# EAGLE schematic prototype_board (EAGLE 6.3)
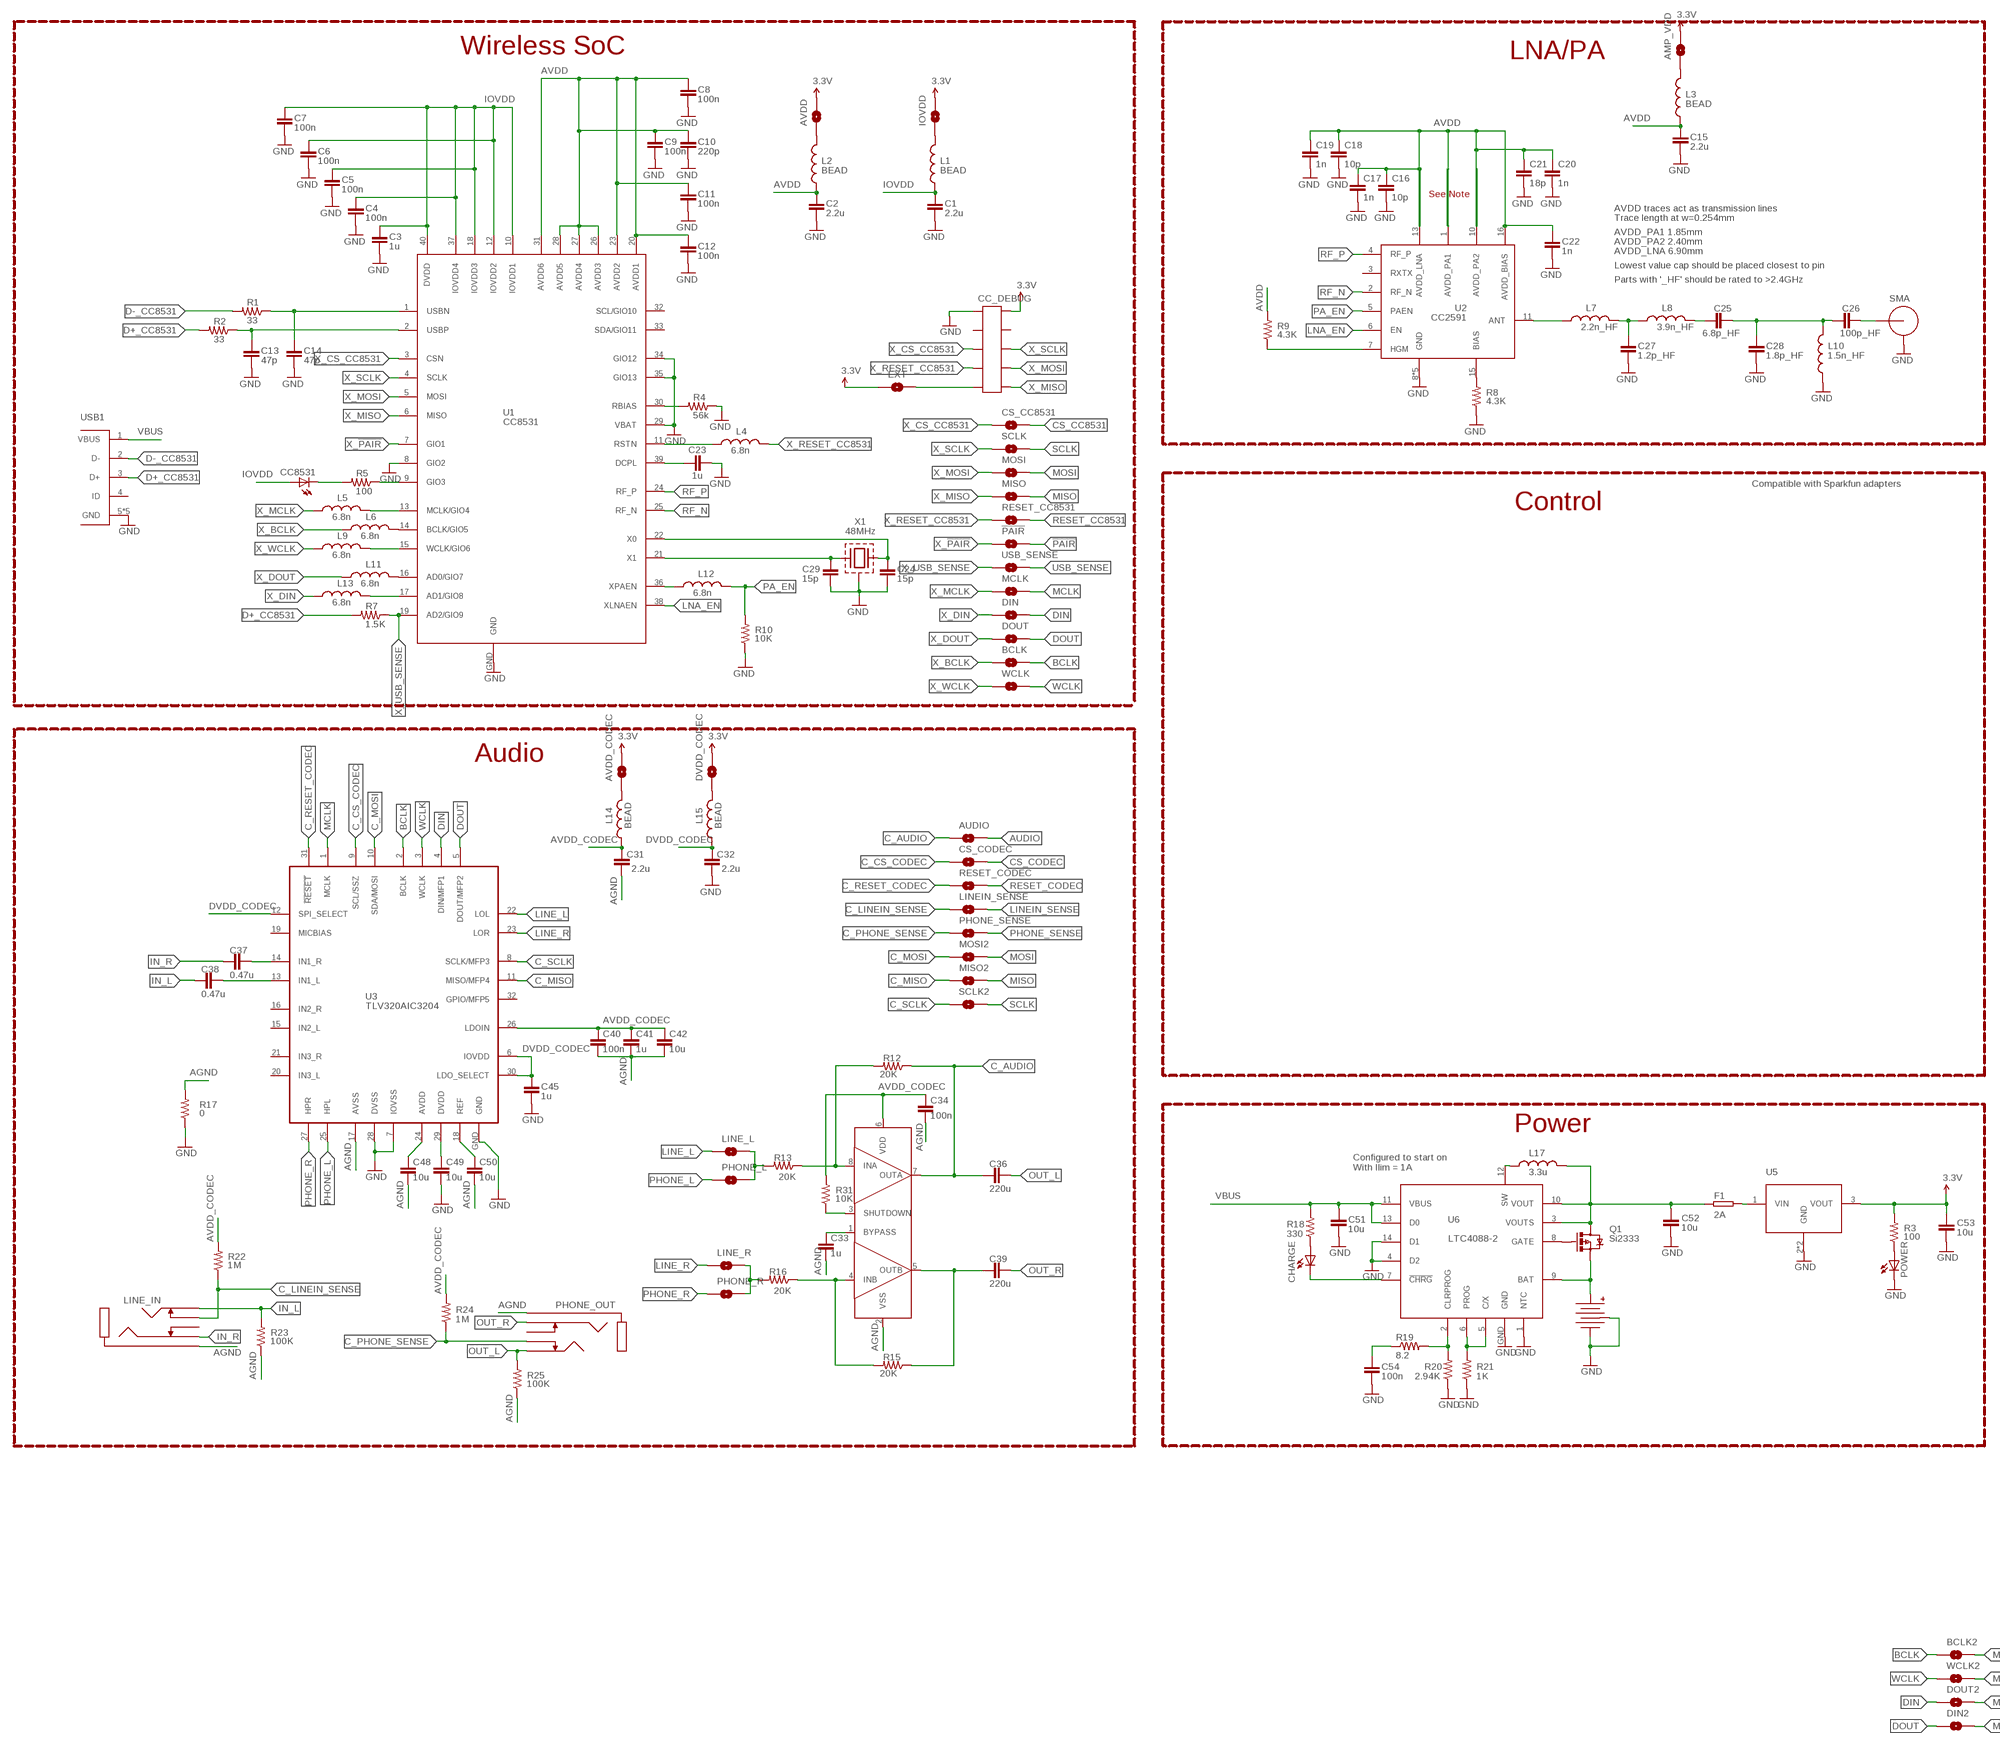
[diagram p0: schematic, sheet 1, part 1 of 3]
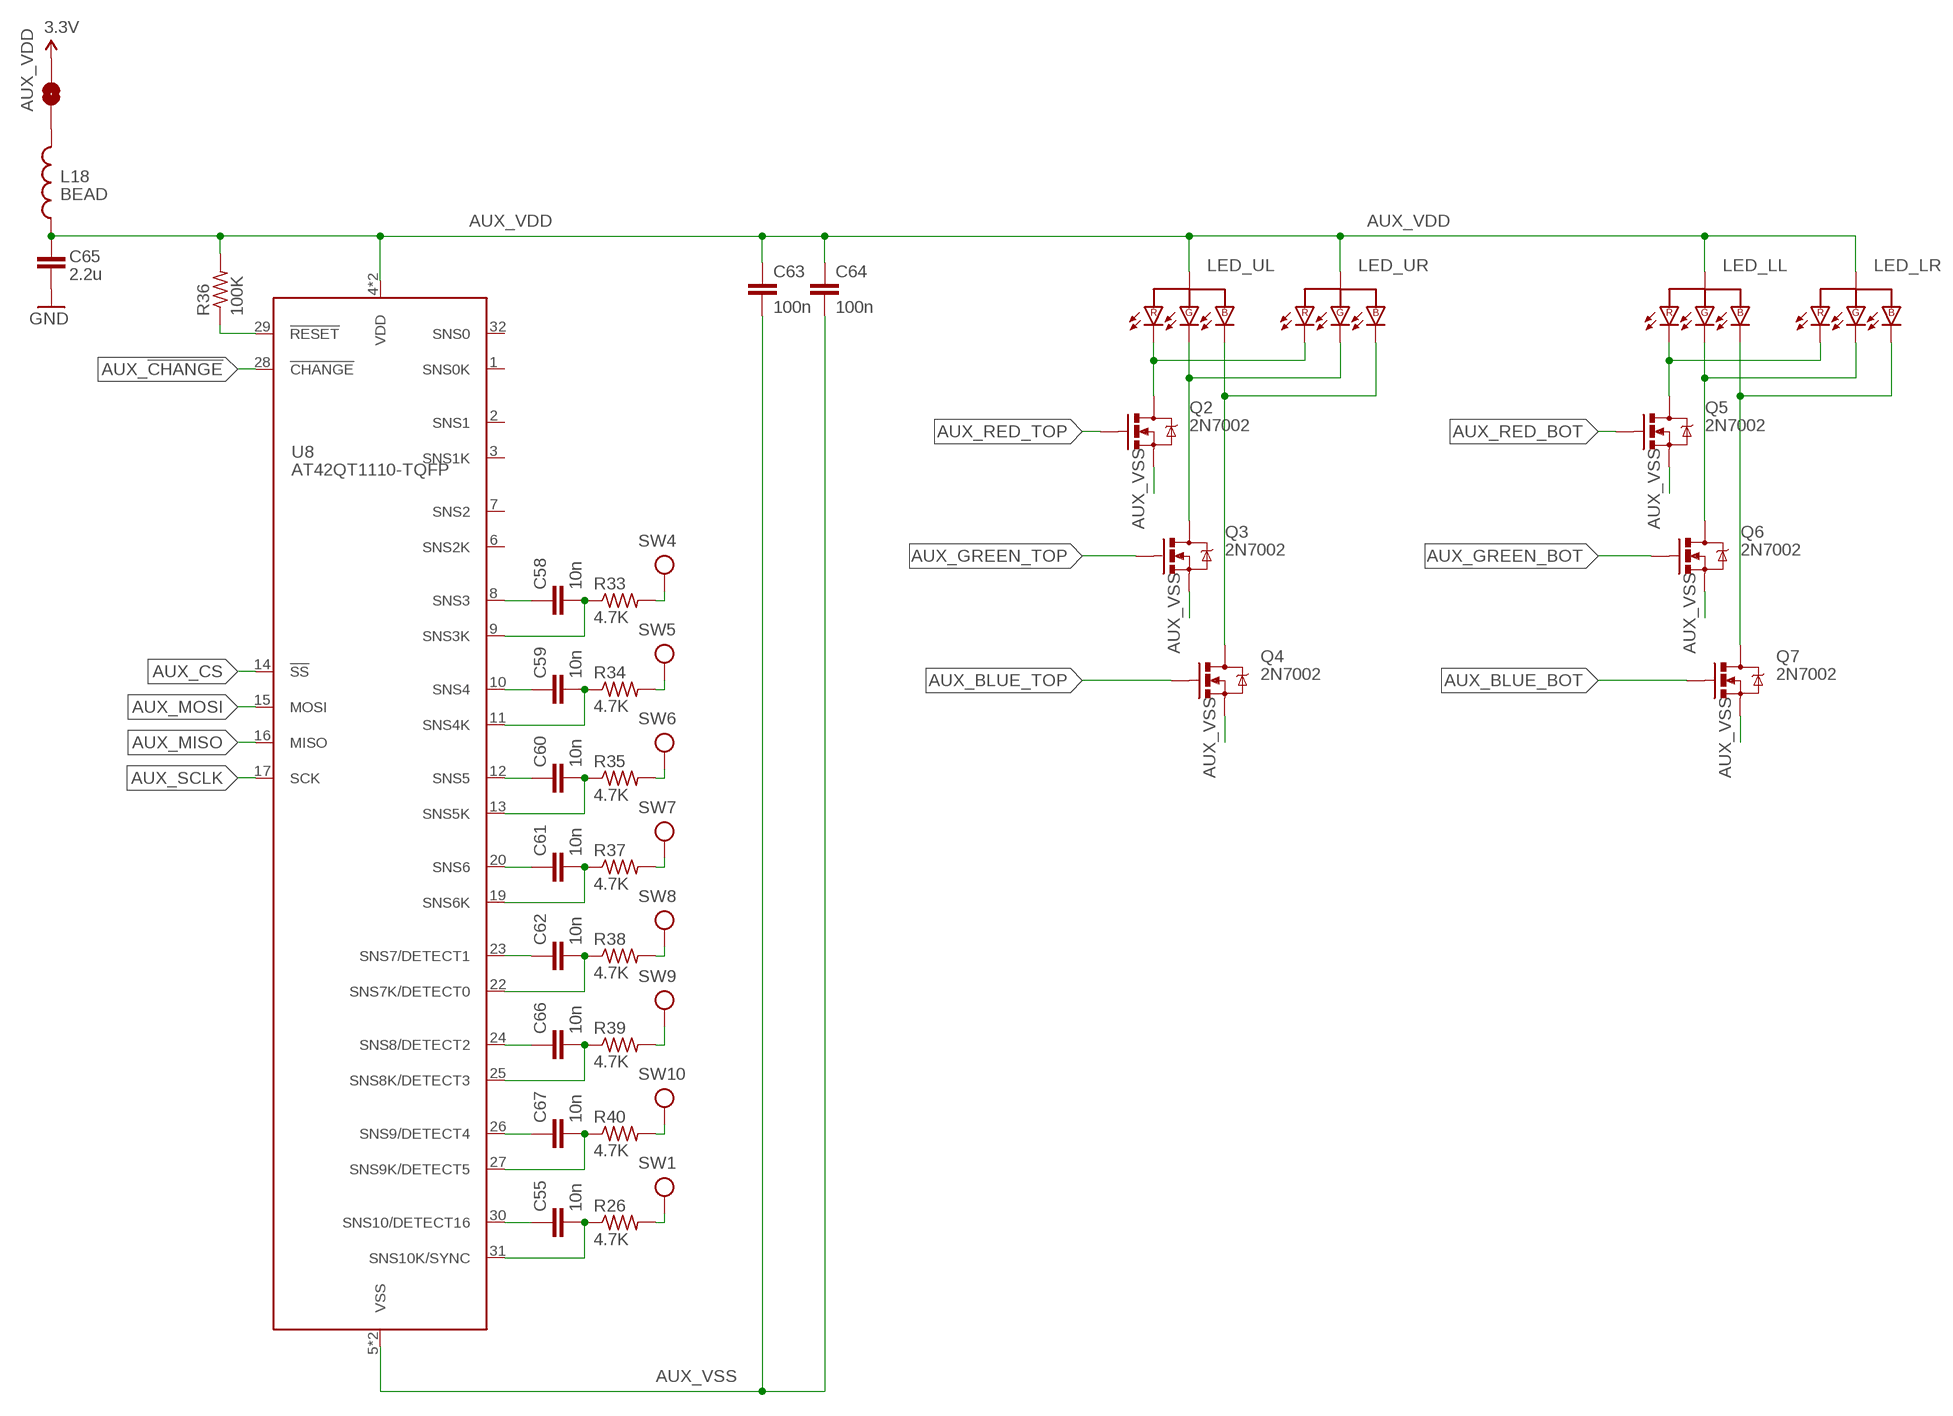
[diagram p1: schematic, sheet 1, part 2 of 3]
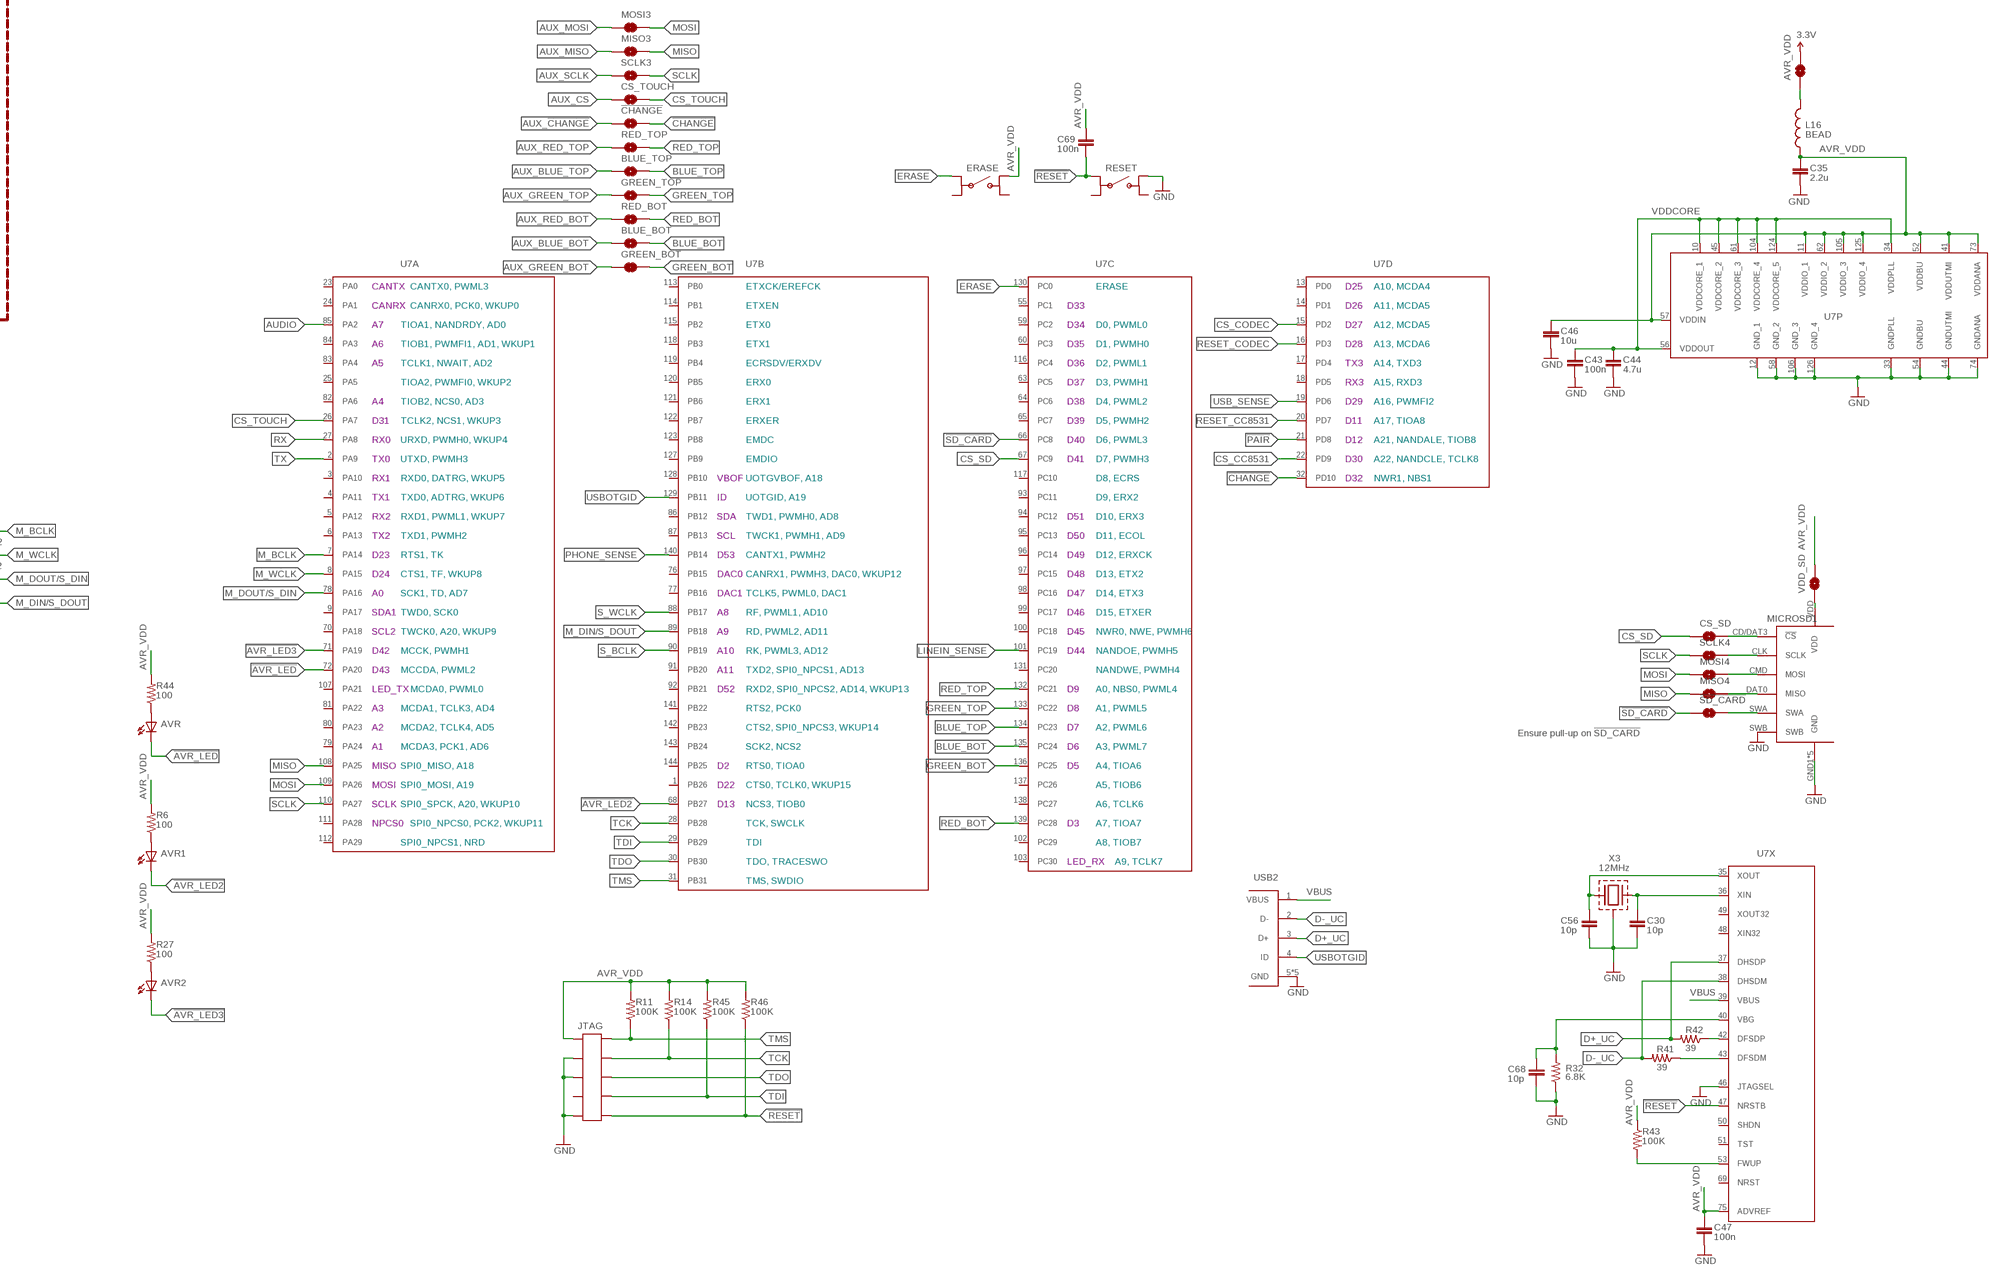
[diagram p2: schematic, sheet 1, part 3 of 3]

## Parts
!CHANGE  SOLDERJUMPERNO  [SJ_2S-NO]
!PAIR  SOLDERJUMPERNO  [SJ_2S-NO]
!SD_CARD  SOLDERJUMPERNO  [SJ_2S-NO]
AMP_VDD  SOLDERJUMPERNO  [SJ_2S-NO]
AUDIO  SOLDERJUMPERNO  [SJ_2S-NO]
AUX_VDD  SOLDERJUMPERNO  [SJ_2S-NO]
AVDD  SOLDERJUMPERNO  [SJ_2S-NO]
AVDD_CODEC  SOLDERJUMPERNO  [SJ_2S-NO]
AVR  LED1206  [LED-1206]
AVR1  LED1206  [LED-1206]
AVR2  LED1206  [LED-1206]
AVR_VDD  SOLDERJUMPERNO  [SJ_2S-NO]
BATTERY  BATTERY-LIPO-JST  [1775469-2]
BCLK  SOLDERJUMPERNO  [SJ_2S-NO]
BCLK2  SOLDERJUMPERNO  [SJ_2S-NO]
BLUE_BOT  SOLDERJUMPERNO  [SJ_2S-NO]
BLUE_TOP  SOLDERJUMPERNO  [SJ_2S-NO]
C1  2.2u  C-EUC0603  [C0603]
C2  2.2u  C-EUC0603  [C0603]
C3  1u  C-EUC0603  [C0603]
C4  100n  C-EUC0603  [C0603]
C5  100n  C-EUC0603  [C0603]
C6  100n  C-EUC0603  [C0603]
C7  100n  C-EUC0603  [C0603]
C8  100n  C-EUC0603  [C0603]
C9  100n  C-EUC0603  [C0603]
C10  220p  C-EUC0603  [C0603]
C11  100n  C-EUC0603  [C0603]
C12  100n  C-EUC0603  [C0603]
C13  47p  C-EUC0603  [C0603]
C14  47p  C-EUC0603  [C0603]
C15  2.2u  C-EUC0603  [C0603]
C16  10p  C-EUC0603  [C0603]
C17  1n  C-EUC0603  [C0603]
C18  10p  C-EUC0603  [C0603]
C19  1n  C-EUC0603  [C0603]
C20  1n  C-EUC0603  [C0603]
C21  18p  C-EUC0603  [C0603]
C22  1n  C-EUC0603  [C0603]
C23  1u  C-EUC0603  [C0603]
C24  15p  C-EUC0603  [C0603]
C25  6.8p_HF  C-EUC0603  [C0603]
C26  100p_HF  C-EUC0603  [C0603]
C27  1.2p_HF  C-EUC0603  [C0603]
C28  1.8p_HF  C-EUC0603  [C0603]
C29  15p  C-EUC0603  [C0603]
C30  10p  C-EUC0603  [C0603]
C31  2.2u  C-EUC0603  [C0603]
C32  2.2u  C-EUC0603  [C0603]
C33  1u  C-EUC0603  [C0603]
C34  100n  C-EUC0603  [C0603]
C35  2.2u  C-EUC0603  [C0603]
C36  220u  C-EUC1210  [C1210]
C37  0.47u  C-EUC0603  [C0603]
C38  0.47u  C-EUC0603  [C0603]
C39  220u  C-EUC1210  [C1210]
C40  100n  C-EUC0603  [C0603]
C41  1u  C-EUC0603  [C0603]
C42  10u  C-EUC0603  [C0603]
C43  100n  C-EUC0603  [C0603]
C44  4.7u  C-EUC0603  [C0603]
C45  1u  C-EUC0603  [C0603]
C46  10u  C-EUC0603  [C0603]
C47  100n  C-EUC0603  [C0603]
C48  10u  C-EUC0603  [C0603]
C49  10u  C-EUC0603  [C0603]
C50  10u  C-EUC0603  [C0603]
C51  10u  C-EUC0603  [C0603]
C52  10u  C-EUC0603  [C0603]
C53  10u  C-EUC0603  [C0603]
C54  100n  C-EUC0603  [C0603]
C55  10n  C-EUC0603  [C0603]
C56  10p  C-EUC0603  [C0603]
C58  10n  C-EUC0603  [C0603]
C59  10n  C-EUC0603  [C0603]
C60  10n  C-EUC0603  [C0603]
C61  10n  C-EUC0603  [C0603]
C62  10n  C-EUC0603  [C0603]
C63  100n  C-EUC0603  [C0603]
C64  100n  C-EUC0603  [C0603]
C65  2.2u  C-EUC0603  [C0603]
C66  10n  C-EUC0603  [C0603]
C67  10n  C-EUC0603  [C0603]
C68  10p  C-EUC0603  [C0603]
C69  100n  C-EUC0603  [C0603]
CC8531  LED1206  [LED-1206]
CC_DEBUG  HEADER-10P-SMD-MALE2  [HEADER-10P-1.27MM]
CHARGE  LED1206  [LED-1206]
CS_CC8531  SOLDERJUMPERNO  [SJ_2S-NO]
CS_CODEC  SOLDERJUMPERNO  [SJ_2S-NO]
CS_SD  SOLDERJUMPERNO  [SJ_2S-NO]
CS_TOUCH  SOLDERJUMPERNO  [SJ_2S-NO]
DIN  SOLDERJUMPERNO  [SJ_2S-NO]
DIN2  SOLDERJUMPERNO  [SJ_2S-NO]
DOUT  SOLDERJUMPERNO  [SJ_2S-NO]
DOUT2  SOLDERJUMPERNO  [SJ_2S-NO]
DVDD_CODEC  SOLDERJUMPERNO  [SJ_2S-NO]
ERASE  TACT_SWITCH-PTS-525  [PTS-525]
EXT  SOLDERJUMPERNO  [SJ_2S-NO]
F1  2A  PTC_FUSE  [1210]
GREEN_BOT  SOLDERJUMPERNO  [SJ_2S-NO]
GREEN_TOP  SOLDERJUMPERNO  [SJ_2S-NO]
IOVDD  SOLDERJUMPERNO  [SJ_2S-NO]
JTAG  HEADER-10P-SMD-MALE2  [HEADER-10P-1.27MM]
L1  BEAD  INDUCTOR0603  [0603]
L2  BEAD  INDUCTOR0603  [0603]
L3  BEAD  INDUCTOR0603  [0603]
L4  6.8n  INDUCTOR0603  [0603]
L5  6.8n  INDUCTOR0603  [0603]
L6  6.8n  INDUCTOR0603  [0603]
L7  2.2n_HF  INDUCTOR0603  [0603]
L8  3.9n_HF  INDUCTOR0603  [0603]
L9  6.8n  INDUCTOR0603  [0603]
L10  1.5n_HF  INDUCTOR0603  [0603]
L11  6.8n  INDUCTOR0603  [0603]
L12  6.8n  INDUCTOR0603  [0603]
L13  6.8n  INDUCTOR0603  [0603]
L14  BEAD  INDUCTOR0603  [0603]
L15  BEAD  INDUCTOR0603  [0603]
L16  BEAD  INDUCTOR0603  [0603]
L17  3.3u  IFSC-1111AB-01  [IFSC-1111AB-01]
L18  BEAD  INDUCTOR0603  [0603]
LED_LL  LED_RGB  [PLCC-4]
LED_LR  LED_RGB  [PLCC-4]
LED_UL  LED_RGB  [PLCC-4]
LED_UR  LED_RGB  [PLCC-4]
LINE_IN  PHONE_SW-STX-35332-5N  [STX-35332-5N]
LINE_L  SOLDERJUMPERNO  [SJ_2S-NO]
LINE_R  SOLDERJUMPERNO  [SJ_2S-NO]
LINEIN_SENSE  SOLDERJUMPERNO  [SJ_2S-NO]
MCLK  SOLDERJUMPERNO  [SJ_2S-NO]
MICROSD1  MICROSD104031-0811  [MOLEX_104031-0811]
MISO  SOLDERJUMPERNO  [SJ_2S-NO]
MISO2  SOLDERJUMPERNO  [SJ_2S-NO]
MISO3  SOLDERJUMPERNO  [SJ_2S-NO]
MISO4  SOLDERJUMPERNO  [SJ_2S-NO]
MOSI  SOLDERJUMPERNO  [SJ_2S-NO]
MOSI2  SOLDERJUMPERNO  [SJ_2S-NO]
MOSI3  SOLDERJUMPERNO  [SJ_2S-NO]
MOSI4  SOLDERJUMPERNO  [SJ_2S-NO]
PHONE_L  SOLDERJUMPERNO  [SJ_2S-NO]
PHONE_OUT  PHONE_SW-STX-35332-5N  [STX-35332-5N]
PHONE_R  SOLDERJUMPERNO  [SJ_2S-NO]
PHONE_SENSE  SOLDERJUMPERNO  [SJ_2S-NO]
POWER  LED1206  [LED-1206]
Q1  Si2333  MOSFET-PCHANNELSMD  [SOT23-3]
Q2  2N7002  MOSFET-NCHANNELSMD  [SOT23-3]
Q3  2N7002  MOSFET-NCHANNELSMD  [SOT23-3]
Q4  2N7002  MOSFET-NCHANNELSMD  [SOT23-3]
Q5  2N7002  MOSFET-NCHANNELSMD  [SOT23-3]
Q6  2N7002  MOSFET-NCHANNELSMD  [SOT23-3]
Q7  2N7002  MOSFET-NCHANNELSMD  [SOT23-3]
R1  33  R-US_R0603  [R0603]
R2  33  R-US_R0603  [R0603]
R3  100  R-US_R0603  [R0603]
R4  56k  R-US_R0603  [R0603]
R5  100  R-US_R0603  [R0603]
R6  100  R-US_R0603  [R0603]
R7  1.5K  R-US_R0603  [R0603]
R8  4.3K  R-US_R0603  [R0603]
R9  4.3K  R-US_R0603  [R0603]
R10  10K  R-US_R0603  [R0603]
R11  100K  R-US_R0603  [R0603]
R12  20K  R-US_R0603  [R0603]
R13  20K  R-US_R0603  [R0603]
R14  100K  R-US_R0603  [R0603]
R15  20K  R-US_R0603  [R0603]
R16  20K  R-US_R0603  [R0603]
R17  0  R-US_R0603  [R0603]
R18  330  R-US_R0603  [R0603]
R19  8.2  R-US_R0603  [R0603]
R20  2.94K  R-US_R0603  [R0603]
R21  1K  R-US_R0603  [R0603]
R22  1M  R-US_R0603  [R0603]
R23  100K  R-US_R0603  [R0603]
R24  1M  R-US_R0603  [R0603]
R25  100K  R-US_R0603  [R0603]
R26  4.7K  R-US_R0603  [R0603]
R27  100  R-US_R0603  [R0603]
R31  10K  R-US_R0603  [R0603]
R32  6.8K  R-US_R0603  [R0603]
R33  4.7K  R-US_R0603  [R0603]
R34  4.7K  R-US_R0603  [R0603]
R35  4.7K  R-US_R0603  [R0603]
R36  100K  R-US_R0603  [R0603]
R37  4.7K  R-US_R0603  [R0603]
R38  4.7K  R-US_R0603  [R0603]
R39  4.7K  R-US_R0603  [R0603]
R40  4.7K  R-US_R0603  [R0603]
R41  39  R-US_R0603  [R0603]
R42  39  R-US_R0603  [R0603]
R43  100K  R-US_R0603  [R0603]
R44  100  R-US_R0603  [R0603]
R45  100K  R-US_R0603  [R0603]
R46  100K  R-US_R0603  [R0603]
RED_BOT  SOLDERJUMPERNO  [SJ_2S-NO]
RED_TOP  SOLDERJUMPERNO  [SJ_2S-NO]
RESET  TACT_SWITCH-PTS-525  [PTS-525]
RESET_CC8531  SOLDERJUMPERNO  [SJ_2S-NO]
RESET_CODEC  SOLDERJUMPERNO  [SJ_2S-NO]
SCLK  SOLDERJUMPERNO  [SJ_2S-NO]
SCLK2  SOLDERJUMPERNO  [SJ_2S-NO]
SCLK3  SOLDERJUMPERNO  [SJ_2S-NO]
SCLK4  SOLDERJUMPERNO  [SJ_2S-NO]
SMA  SMA-REVSMA-0.62  [CONREVSMA003.062]
SW1  TOUCH_PAD-CIRCLE-15MM  [TOUCH-CIRCLE-15MM]
SW4  TOUCH_PAD-CIRCLE-15MM  [TOUCH-CIRCLE-15MM]
SW5  TOUCH_PAD-CIRCLE-15MM  [TOUCH-CIRCLE-15MM]
SW6  TOUCH_PAD-CIRCLE-15MM  [TOUCH-CIRCLE-15MM]
SW7  TOUCH_PAD-CIRCLE-15MM  [TOUCH-CIRCLE-15MM]
SW8  TOUCH_PAD-CIRCLE-15MM  [TOUCH-CIRCLE-15MM]
SW9  TOUCH_PAD-CIRCLE-15MM  [TOUCH-CIRCLE-15MM]
SW10  TOUCH_PAD-CIRCLE-15MM  [TOUCH-CIRCLE-15MM]
U1  CC8531  [S-PVQFN-N40]
U2  CC2591  [S-PVQFN-N16]
U3  TLV320AIC3204  [S-PVQFN-N32]
U5  MCP1826-SOT223  [SOT-223]
U6  LTC4088-2  LTC4088-1/2  [DFN-14]
U7  ATSAM3X8E_ALT-LQFP-144  [LQFP-144]
U8  AT42QT1110-TQFP  [S-PQFP-N32]
U9  LM4881  [SO08]
USB1  USB_MICRO_AB  [USB_MICRO_AB]
USB2  USB_MICRO_AB  [USB_MICRO_AB]
USB_SENSE  SOLDERJUMPERNO  [SJ_2S-NO]
VDD_SD  SOLDERJUMPERNO  [SJ_2S-NO]
WCLK  SOLDERJUMPERNO  [SJ_2S-NO]
WCLK2  SOLDERJUMPERNO  [SJ_2S-NO]
X1  48MHz  XTAL-ABRACONABM3C  [ABM3C]
X3  12MHz  XTAL-ABRACONABM8G  [ABM8G]

## Nets
3.3V [Power]: AMP_VDD.2 AUX_VDD.2 AVDD.2 AVDD_CODEC.2 AVR_VDD.2 C53.1 CC_DEBUG.2 DVDD_CODEC.2 EXT.1 IOVDD.2 R3.2 U5.3(VOUT)
!AVR_LED: AVR.C U7.72(A:PA20)
!AVR_LED2: AVR1.C U7.68(B:PB27)
!AVR_LED3: AVR2.C U7.71(A:PA19)
!CHANGE: !CHANGE.2 U7.32(D:PD10)
!PAIR: !PAIR.2 U7.21(D:PD8)
!RESET: C69.2 JTAG.10 R46.1 RESET.1 U7.47(X:NRSTB)
!SD_CARD: !SD_CARD.1 U7.66(C:PC8)
AGND [Analog]: C31.2 C33.2 C34.2 C40.2 C41.2 C42.2 C48.2 C50.2 LINE_IN.5(GND) PHONE_OUT.5(GND) R17.2 R23.1 R25.1 U3.17(AVSS) U9.2(VSS)
AUDIO: AUDIO.2 U7.85(A:PA2)
AUX_!CHANGE: !CHANGE.1 U8.28(!CHANGE)
AUX_BLUE_BOT: BLUE_BOT.1 Q7.1(G)
AUX_BLUE_TOP: BLUE_TOP.1 Q4.1(G)
AUX_CS: CS_TOUCH.1 U8.14(!SS)
AUX_GREEN_BOT: GREEN_BOT.1 Q6.1(G)
AUX_GREEN_TOP: GREEN_TOP.1 Q3.1(G)
AUX_MISO: MISO3.1 U8.16(MISO)
AUX_MOSI: MOSI3.1 U8.15(MOSI)
AUX_RED_BOT: Q5.1(G) RED_BOT.1
AUX_RED_TOP: Q2.1(G) RED_TOP.1
AUX_SCLK: SCLK3.1 U8.17(SCK)
AUX_VDD: C63.1 C64.1 C65.1 L18.1 LED_LL.2(A) LED_LL.2-2(A) LED_LR.2(A) LED_LR.2-2(A) LED_UL.2(A) LED_UL.2-2(A) LED_UR.2(A) LED_UR.2-2(A) R36.2 U8.4(VDD) U8.18(VDD)
AUX_VSS: C63.2 C64.2 Q2.2(S) Q3.2(S) Q4.2(S) Q5.2(S) Q6.2(S) Q7.2(S) U8.5(VSS) U8.21(VSS)
AVDD: C2.1 C8.1 C9.1 C10.1 C11.1 C12.1 C15.1 C16.1 C17.1 C18.1 C19.1 C20.1 C21.1 C22.1 L2.1 L3.1 R9.2 U1.20(AVDD1) U1.23(AVDD2) U1.26(AVDD3) U1.27(AVDD4) U1.28(AVDD5) U1.31(AVDD6) U2.1(AVDD_PA1) U2.10(AVDD_PA2) U2.13(AVDD_LNA) U2.16(AVDD_BIAS)
AVDD_CODEC: C31.1 C34.1 C40.1 C41.1 C42.1 L14.1 R22.2 R24.2 R31.2 U3.26(LDOIN) U9.6(VDD)
AVR_VDD: C35.1 C46.1 C47.1 C69.1 ERASE.3 JTAG.1 L16.1 R6.2 R11.2 R14.2 R27.2 R43.1 R44.2 R45.2 R46.2 U7.11(P:VDDIO_1) U7.41(P:VDDUTMI) U7.52(P:VDDBU) U7.57(P:VDDIN) U7.62(P:VDDIO_2) U7.73(P:VDDANA) U7.75(X:ADVREF) U7.105(P:VDDIO_3) U7.125(P:VDDIO_4) VDD_SD.2
BAT [Power]: BATTERY.+(P) Q1.2(S) U6.9(BAT)
BCLK: BCLK2.1 BCLK.2 U3.2(BCLK)
BLUE_BOT: BLUE_BOT.2 U7.135(C:PC24)
BLUE_TOP: BLUE_TOP.2 U7.134(C:PC23)
C_AUDIO: AUDIO.1 C36.1 R12.1 U9.7(OUTA)
C_CS_CODEC: CS_CODEC.1 U3.9(SCL/SSZ)
C_LINEIN_SENSE: LINE_IN.3(L_SW) LINEIN_SENSE.1 R22.1
C_MISO: MISO2.1 U3.11(MISO/MFP4)
C_MOSI: MOSI2.1 U3.10(SDA/MOSI)
C_PHONE_SENSE: PHONE_OUT.3(L_SW) PHONE_SENSE.1 R24.1
C_RESET_CODEC: RESET_CODEC.1 U3.31(!RESET)
C_SCLK: SCLK2.1 U3.8(SCLK/MFP3)
CS_CC8531: CS_CC8531.2 U7.22(D:PD9)
CS_CODEC: CS_CODEC.2 U7.15(D:PD2)
CS_SD: CS_SD.1 U7.67(C:PC9)
CS_TOUCH: CS_TOUCH.2 U7.26(A:PA7)
D+_CC8531: R2.2 R7.2 USB1.3(D+)
D+_UC: R42.2 U7.37(X:DHSDP) USB2.3(D+)
D-_CC8531: R1.2 USB1.2(D-)
D-_UC: R41.2 U7.38(X:DHSDM) USB2.2(D-)
DIN: DIN.2 DOUT2.1 U3.4(DIN/MFP1)
DOUT: DIN2.1 DOUT.2 U3.5(DOUT/MFP2)
DVDD: C49.1 U3.29(DVDD)
DVDD_CODEC: C32.1 C45.1 L15.1 U3.6(IOVDD) U3.12(SPI_SELECT) U3.30(LDO_SELECT)
ERASE: ERASE.1 U7.130(C:PC0)
GND [Power]: BATTERY.-(N) BATTERY.X1(CASE) BATTERY.X2(CASE) C1.2 C2.2 C3.2 C4.2 C5.2 C6.2 C7.2 C8.2 C9.2 C10.2 C11.2 C12.2 C13.2 C14.2 C15.2 C16.2 C17.2 C18.2 C19.2 C20.2 C21.2 C22.2 C23.2 C24.2 C27.2 C28.2 C29.2 C30.2 C32.2 C35.2 C43.2 C44.2 C45.2 C46.2 C47.2 C49.2 C51.2 C52.2 C53.2 C54.2 C56.2 C65.2 C68.2 CC_DEBUG.1 JTAG.3 JTAG.5 JTAG.9 L10.1 MICROSD1.GND1(GND) MICROSD1.GND2(GND) MICROSD1.GND3(GND) MICROSD1.GND4(GND) MICROSD1.SWB MICROSD1.VSS(GND) POWER.C R4.1 R8.1 R10.1 R17.1 R20.1 R21.1 R32.1 RESET.3 SMA.GND1(GND) SMA.GND2(GND) SMA.GND3(GND) SMA.GND4(GND) U1.8(GIO2) U1.29(VBAT) U1.34(GIO12) U1.35(GIO13) U1.GND U2.8(GND) U2.9(GND) U2.12(GND) U2.14(GND) U2.GND U3.7(IOVSS) U3.28(DVSS) U3.GND U5.2(GND) U5.4(GND) U6.1(NTC) U6.4(D2) U6.14(D1) U6.GND U7.12(P:GND_1) U7.33(P:GNDPLL) U7.44(P:GNDUTMI) U7.46(X:JTAGSEL) U7.54(P:GNDBU) U7.58(P:GND_2) U7.74(P:GNDANA) U7.106(P:GND_3) U7.126(P:GND_4) USB1.5(GND) USB1.GND1(GND) USB1.GND2(GND) USB1.GND3(GND) USB1.GND4(GND) USB2.5(GND) USB2.GND1(GND) USB2.GND2(GND) USB2.GND3(GND) USB2.GND4(GND) X1.2(CASE) X1.4(CASE) X3.GND-1(CASE) X3.GND-2(CASE)
GREEN_BOT: GREEN_BOT.2 U7.136(C:PC25)
GREEN_TOP: GREEN_TOP.2 U7.133(C:PC22)
IN_L: C38.1 LINE_IN.4(L) R23.2
IN_R: C37.1 LINE_IN.1(R)
IOVDD: C1.1 C3.1 C4.1 C5.1 C6.1 C7.1 CC8531.A L1.1 U1.10(IOVDD1) U1.12(IOVDD2) U1.18(IOVDD3) U1.37(IOVDD4) U1.40(DVDD)
IOVDD1: C14.1 R1.1 U1.1(USBN)
IOVDD2: C13.1 R2.1 U1.2(USBP)
LINE_L: LINE_L.1 U3.22(LOL)
LINE_R: LINE_R.1 U3.23(LOR)
LINEIN_SENSE: LINEIN_SENSE.2 U7.101(C:PC19)
LNA_EN: U1.38(XLNAEN) U2.6(EN)
M_BCLK: BCLK2.2 U7.7(A:PA14)
M_DIN/S_DOUT: DIN2.2 U7.89(B:PB18)
M_DOUT/S_DIN: DOUT2.2 U7.78(A:PA16)
M_WCLK: U7.8(A:PA15) WCLK2.2
MCLK: MCLK.2 U3.1(MCLK)
MISO: MISO2.2 MISO3.2 MISO4.1 MISO.2 U7.108(A:PA25)
MOSI: MOSI2.2 MOSI3.2 MOSI4.1 MOSI.2 U7.109(A:PA26)
N$1: C29.1 U1.21(X1) X1.1
N$2: C24.1 U1.22(X0) X1.3
N$3: L4.1 U1.11(RSTN)
N$4: L11.2 U1.16(AD0/GIO7)
N$5: L6.2 U1.14(BCLK/GIO5)
N$6: C56.1 U7.35(X:XOUT) X3.X1
N$7: R8.2 U2.15(BIAS)
N$8: R9.1 U2.7(HGM)
N$9: C26.2 SMA.SIG
N$10: C55.2 R26.1 U8.31(SNS10K/SYNC)
N$11: C55.1 U8.30(SNS10/DETECT16)
N$12: AVR.A R44.1
N$13: L7.1 U2.11(ANT)
N$14: C27.1 L7.2 L8.1
N$15: C25.1 L8.2
N$16: C25.2 C26.1 C28.1 L10.2
N$17: C48.1 U3.24(AVDD)
N$18: L12.1 U1.36(XPAEN)
N$19: R4.2 U1.30(RBIAS)
N$20: AVDD.1 L2.2
N$21: C23.1 U1.39(DCPL)
N$22: F1.2 U5.1(VIN)
N$23: L5.2 U1.13(MCLK/GIO4)
N$24: IOVDD.1 L1.2
N$25: L9.2 U1.15(WCLK/GIO6)
N$26: C33.1 U9.1(BYPASS)
N$27: L13.2 U1.17(AD1/GIO8)
N$28: R5.1 U1.9(GIO3)
N$29: CC8531.C R5.2
N$30: C58.2 R33.1 U8.9(SNS3K)
N$31: POWER.A R3.1
N$32: CHARGE.C U6.7(!CHRG)
N$33: CHARGE.A R18.1
N$34 [Analog]: C37.2 U3.14(IN1_R)
N$35 [Analog]: C38.2 U3.13(IN1_L)
N$36: L17.1 U6.12(SW)
N$37: R21.2 U6.5(C/X) U6.6(PROG)
N$38: R19.2 R20.2 U6.2(CLRPROG)
N$39: AVDD_CODEC.1 L14.2
N$40: C39.1 R15.1 U9.5(OUTB)
N$41: C59.2 R34.1 U8.11(SNS4K)
N$42: C60.2 R35.1 U8.13(SNS5K)
N$43: LINE_L.2 PHONE_L.2 R13.2
N$44: R26.2 SW1.P$1
N$45: LINE_R.2 PHONE_R.2 R16.2
N$46: DVDD_CODEC.1 L15.2
N$47: AUX_VDD.1 L18.2
N$48: C54.1 R19.1
N$49 [Power]: C52.1 F1.1 L17.2 Q1.3(D) U6.3(VOUTS) U6.10(VOUT)
N$50: CC_DEBUG.9 EXT.2
N$51: Q1.1(G) U6.8(GATE)
N$52: AMP_VDD.1 L3.2
N$53: R12.2 R13.1 U9.8(INA)
N$54: R15.2 R16.1 U9.4(INB)
N$55: R31.1 U9.3(SHUTDOWN)
N$56: LED_UL.1(KR) LED_UL.1-2(KR) LED_UR.1(KR) LED_UR.1-2(KR) Q2.3(D)
N$57: CS_SD.2 MICROSD1.CD/DAT3(!CS)
N$58: LED_UL.4(KG) LED_UL.4-2(KG) LED_UR.4(KG) LED_UR.4-2(KG) Q3.3(D)
N$59: C30.1 U7.36(X:XIN) X3.X2
N$60: C58.1 U8.8(SNS3)
N$61: R33.2 SW4.P$1
N$62: C59.1 U8.10(SNS4)
N$63: R34.2 SW5.P$1
N$64: C60.1 U8.12(SNS5)
N$65: R35.2 SW6.P$1
N$66: C66.2 R39.1 U8.25(SNS8K/DETECT3)
N$67: MICROSD1.CLK(SCLK) SCLK4.2
N$68: C67.2 R40.1 U8.27(SNS9K/DETECT5)
N$69: C66.1 U8.24(SNS8/DETECT2)
N$70: R39.2 SW9.P$1
N$71: C61.2 R37.1 U8.19(SNS6K)
N$72: R37.2 SW7.P$1
N$73: C62.2 R38.1 U8.22(SNS7K/DETECT0)
N$74: R38.2 SW8.P$1
N$75: C62.1 U8.23(SNS7/DETECT1)
N$76: C61.1 U8.20(SNS6)
N$77: R36.1 U8.29(!RESET)
N$78: LED_UL.3(KB) LED_UL.3-2(KB) LED_UR.3(KB) LED_UR.3-2(KB) Q4.3(D)
N$79: LED_LL.1(KR) LED_LL.1-2(KR) LED_LR.1(KR) LED_LR.1-2(KR) Q5.3(D)
N$80: LED_LL.4(KG) LED_LL.4-2(KG) LED_LR.4(KG) LED_LR.4-2(KG) Q6.3(D)
N$81: C67.1 U8.26(SNS9/DETECT4)
N$82: R40.2 SW10.P$1
N$83: LED_LL.3(KB) LED_LL.3-2(KB) LED_LR.3(KB) LED_LR.3-2(KB) Q7.3(D)
N$84: MICROSD1.CMD(MOSI) MOSI4.2
N$85: R41.1 U7.43(X:DFSDM)
N$86: R42.1 U7.42(X:DFSDP)
N$87: C68.1 R32.2 U7.40(X:VBG)
N$88: MICROSD1.DAT0(MISO) MISO4.2
N$89: !SD_CARD.2 MICROSD1.SWA
N$90: R43.2 U7.53(X:FWUP)
N$91: MICROSD1.VDD VDD_SD.1
N$92 [Power]: AVR_VDD.1 L16.2
N$93: AVR1.A R6.1
N$94: AVR2.A R27.1
OUT_L: C36.2 PHONE_OUT.4(L) R25.2
OUT_R [Analog]: C39.2 PHONE_OUT.1(R)
PA_EN: L12.2 R10.2 U2.5(PAEN)
PHONE_L: PHONE_L.1 U3.25(HPL)
PHONE_R: PHONE_R.1 U3.27(HPR)
PHONE_SENSE: PHONE_SENSE.2 U7.140(B:PB14)
RED_BOT: RED_BOT.2 U7.139(C:PC28)
RED_TOP: RED_TOP.2 U7.132(C:PC21)
REF: C50.1 U3.18(REF)
RESET_CC8531: RESET_CC8531.2 U7.20(D:PD7)
RESET_CODEC: RESET_CODEC.2 U7.16(D:PD3)
RF_N: U1.25(RF_N) U2.2(RF_N)
RF_P: U1.24(RF_P) U2.4(RF_P)
RX: U7.27(A:PA8)
S_BCLK: U7.90(B:PB19)
S_WCLK: U7.88(B:PB17)
SCLK: SCLK2.2 SCLK3.2 SCLK4.1 SCLK.2 U7.110(A:PA27)
TCK: JTAG.4 R14.1 U7.28(B:PB28)
TDI: JTAG.8 R45.1 U7.29(B:PB29)
TDO: JTAG.6 U7.30(B:PB30)
TMS: JTAG.2 R11.1 U7.31(B:PB31)
TX: U7.2(A:PA9)
USB_SENSE: U7.19(D:PD6) USB_SENSE.2
USBOTGID: U7.129(B:PB11) USB2.4(ID)
VBUS [Power]: C51.1 R18.2 U6.11(VBUS) U6.13(D0) U7.39(X:VBUS) USB1.1(VBUS) USB2.1(VBUS)
VDDCORE: C43.1 C44.1 U7.10(P:VDDCORE_1) U7.34(P:VDDPLL) U7.45(P:VDDCORE_2) U7.56(P:VDDOUT) U7.61(P:VDDCORE_3) U7.104(P:VDDCORE_4) U7.124(P:VDDCORE_5)
WCLK: U3.3(WCLK) WCLK2.1 WCLK.2
X_!PAIR: !PAIR.1 U1.7(GIO1)
X_BCLK: BCLK.1 L6.1
X_CS_CC8531: CC_DEBUG.5 CS_CC8531.1 U1.3(CSN)
X_DIN: DIN.1 L13.1
X_DOUT: DOUT.1 L11.1
X_MCLK: L5.1 MCLK.1
X_MISO: CC_DEBUG.10 MISO.1 U1.6(MISO)
X_MOSI: CC_DEBUG.8 MOSI.1 U1.5(MOSI)
X_RESET_CC8531: CC_DEBUG.7 L4.2 RESET_CC8531.1
X_SCLK: CC_DEBUG.6 SCLK.1 U1.4(SCLK)
X_USB_SENSE: R7.1 U1.19(AD2/GIO9) USB_SENSE.1
X_WCLK: L9.1 WCLK.1
Unconnected: CC_DEBUG.3 CC_DEBUG.4 ERASE.2 ERASE.4 JTAG.7 LINE_IN.2(R_SW) PHONE_OUT.2(R_SW) RESET.2 RESET.4 U1.32(SCL/GIO10) U1.33(SDA/GIO11) U2.3(RXTX) U3.15(IN2_L) U3.16(IN2_R) U3.19(MICBIAS) U3.20(IN3_L) U3.21(IN3_R) U3.32(GPIO/MFP5) U7.1(B:PB26) U7.3(A:PA10) U7.4(A:PA11) U7.5(A:PA12) U7.6(A:PA13) U7.9(A:PA17) U7.13(D:PD0) U7.14(D:PD1) U7.17(D:PD4) U7.18(D:PD5) U7.23(A:PA0) U7.24(A:PA1) U7.25(A:PA5) U7.48(X:XIN32) U7.49(X:XOUT32) U7.50(X:SHDN) U7.51(X:TST) U7.55(C:PC1) U7.59(C:PC2) U7.60(C:PC3) U7.63(C:PC5) U7.64(C:PC6) U7.65(C:PC7) U7.69(X:NRST) U7.70(A:PA18) U7.76(B:PB15) U7.77(B:PB16) U7.79(A:PA24) U7.80(A:PA23) U7.81(A:PA22) U7.82(A:PA6) U7.83(A:PA4) U7.84(A:PA3) U7.86(B:PB12) U7.87(B:PB13) U7.91(B:PB20) U7.92(B:PB21) U7.93(C:PC11) U7.94(C:PC12) U7.95(C:PC13) U7.96(C:PC14) U7.97(C:PC15) U7.98(C:PC16) U7.99(C:PC17) U7.100(C:PC18) U7.102(C:PC29) U7.103(C:PC30) U7.107(A:PA21) U7.111(A:PA28) U7.112(A:PA29) U7.113(B:PB0) U7.114(B:PB1) U7.115(B:PB2) U7.116(C:PC4) U7.117(C:PC10) U7.118(B:PB3) U7.119(B:PB4) U7.120(B:PB5) U7.121(B:PB6) U7.122(B:PB7) U7.123(B:PB8) U7.127(B:PB9) U7.128(B:PB10) U7.131(C:PC20) U7.137(C:PC26) U7.138(C:PC27) U7.141(B:PB22) U7.142(B:PB23) U7.143(B:PB24) U7.144(B:PB25) U8.1(SNS0K) U8.2(SNS1) U8.3(SNS1K) U8.6(SNS2K) U8.7(SNS2) U8.32(SNS0) USB1.4(ID)

## Notes on the sheet
- Wireless SoC | LNA/PA
- See Note
- AVDD traces act as transmission lines
- Trace length at w=0.254mm
- AVDD_PA1 1.85mm
- AVDD_PA2 2.40mm
- AVDD_LNA 6.90mm
- Lowest value cap should be placed closest to pin
- Parts with '_HF' should be rated to >2.4GHz
- Compatible with Sparkfun adapters
- Control
- Audio
- Power
- Configured to start on
  With Ilim = 1A
- Ensure pull-up on !SD_CARD

## Library data of the parts
!CHANGE !PAIR !SD_CARD AMP_VDD AUDIO AUX_VDD AVDD AVDD_CODEC AVR_VDD BCLK BCLK2 BLUE_BOT BLUE_TOP CS_CC8531 CS_CODEC CS_SD CS_TOUCH DIN DIN2 DOUT DOUT2 DVDD_CODEC EXT GREEN_BOT GREEN_TOP IOVDD LINE_L LINE_R LINEIN_SENSE MCLK MISO MISO2-MISO4 MOSI MOSI2-MOSI4 PHONE_L PHONE_R PHONE_SENSE RED_BOT RED_TOP RESET_CC8531 RESET_CODEC SCLK SCLK2-SCLK4 USB_SENSE VDD_SD WCLK WCLK2 = SparkFun-Passives (1):SOLDERJUMPER: Solder Jumper Standard SMD solder jumper. Used to automate production. Two varients : Normally Open and Normally Closed are the same, but have different paste layers. NC will have a large amount of paste and should jumper during reflow.
AVR AVR1 AVR2 CC8531 CHARGE POWER = SparkFun-LED:LED: LEDs Standard schematic elements and footprints for 5mm, 3mm, 1206, and 0603 sized LEDs. 5mm - Spark Fun Electronics SKU : COM-00529 (and others)
BATTERY = 00-EvaLibrary:BATTERY
C1-C29 C31-C35 C37 C38 C40-C50 C52 C53 C55 C58-C67 = rcl:C-EU: CAPACITOR, European symbol
C30 C36 C39 C51 C54 C56 C68 C69 = 00-EvaLibrary:C-EU: CAPACITOR, European symbol
CC_DEBUG JTAG = 00-EvaLibrary:HEADER-10P
ERASE RESET = 00-EvaLibrary:TACT_SWITCH
F1 = 00-EvaLibrary:PTC_FUSE
L1-L16 L18 = SparkFun-Passives:INDUCTOR: Inductors Basic Inductor/Choke - 0603 and 1206. Footprints are not proven and vary greatly between part numbers.
L17 = 00-EvaLibrary:IFSC-1111AB-01
LED_LL LED_LR LED_UL LED_UR = 00-EvaLibrary:LED_RGB
LINE_IN PHONE_OUT = 00-EvaLibrary:PHONE_SW
MICROSD1 = 00-EvaLibrary:MICROSD
Q1 = SparkFun-DiscreteSemi:MOSFET-PCHANNEL: Generic PMOSFET
Q2-Q7 = SparkFun-DiscreteSemi:MOSFET-NCHANNEL: Generic NMOS footprint
R1-R11 R14 R17 R22-R27 R31-R46 = rcl:R-US_: RESISTOR, American symbol
R12 R13 R15 R16 R18-R21 = 00-EvaLibrary:R-US_: RESISTOR, American symbol
SMA = 00-EvaLibrary:SMA
SW1 SW4-SW10 = 00-EvaLibrary:TOUCH_PAD
U1 = 00-EvaLibrary:CC8531
U2 = 00-EvaLibrary:CC2591
U3 = 00-EvaLibrary:TLV320AIC3204
U5 = 00-EvaLibrary:MCP1826
U6 = 00-EvaLibrary:LTC4088-1/2
U7 = 00-EvaLibrary:ATSAM3X8E_ALT
U8 = 00-EvaLibrary:AT42QT1110
U9 = 00-EvaLibrary:LM4881
USB1 USB2 = 00-EvaLibrary:USB_MICRO_AB
X1 X3 = 00-EvaLibrary:XTAL-ABRACON